# Altium schematic sheet Serial.SchDoc
size A3; PageSetup: Record=PageOptions|CenterHorizontal=True|CenterVertical=True|PrintScale=0.73|XCorrection=1.00|YCorrection=1.00|PrintKind=0|BorderSize=5000000|LeftOffset=0|BottomOffset=0|Orientation=2|PaperLength=1000|PaperWidth=1000|Scale=100|PaperSource=7|PrintQuality=-4|MediaType=1|DitherType=10|PaperKind=A4|PrintScaleMode=1; Date: 27.05.2014; DrawnBy: luths8; Organization: BFH; Address1: Bern University of Applied Sciences; Address2: Engineering and Information Technology; Address3: Jlcoweg 1; Address4: CH-3400 Burgdorf; DocumentNumber: 11; Revision: 1.1; SheetNumber: 11; SheetTotal: 16; CurrentDate: 27.05.2014
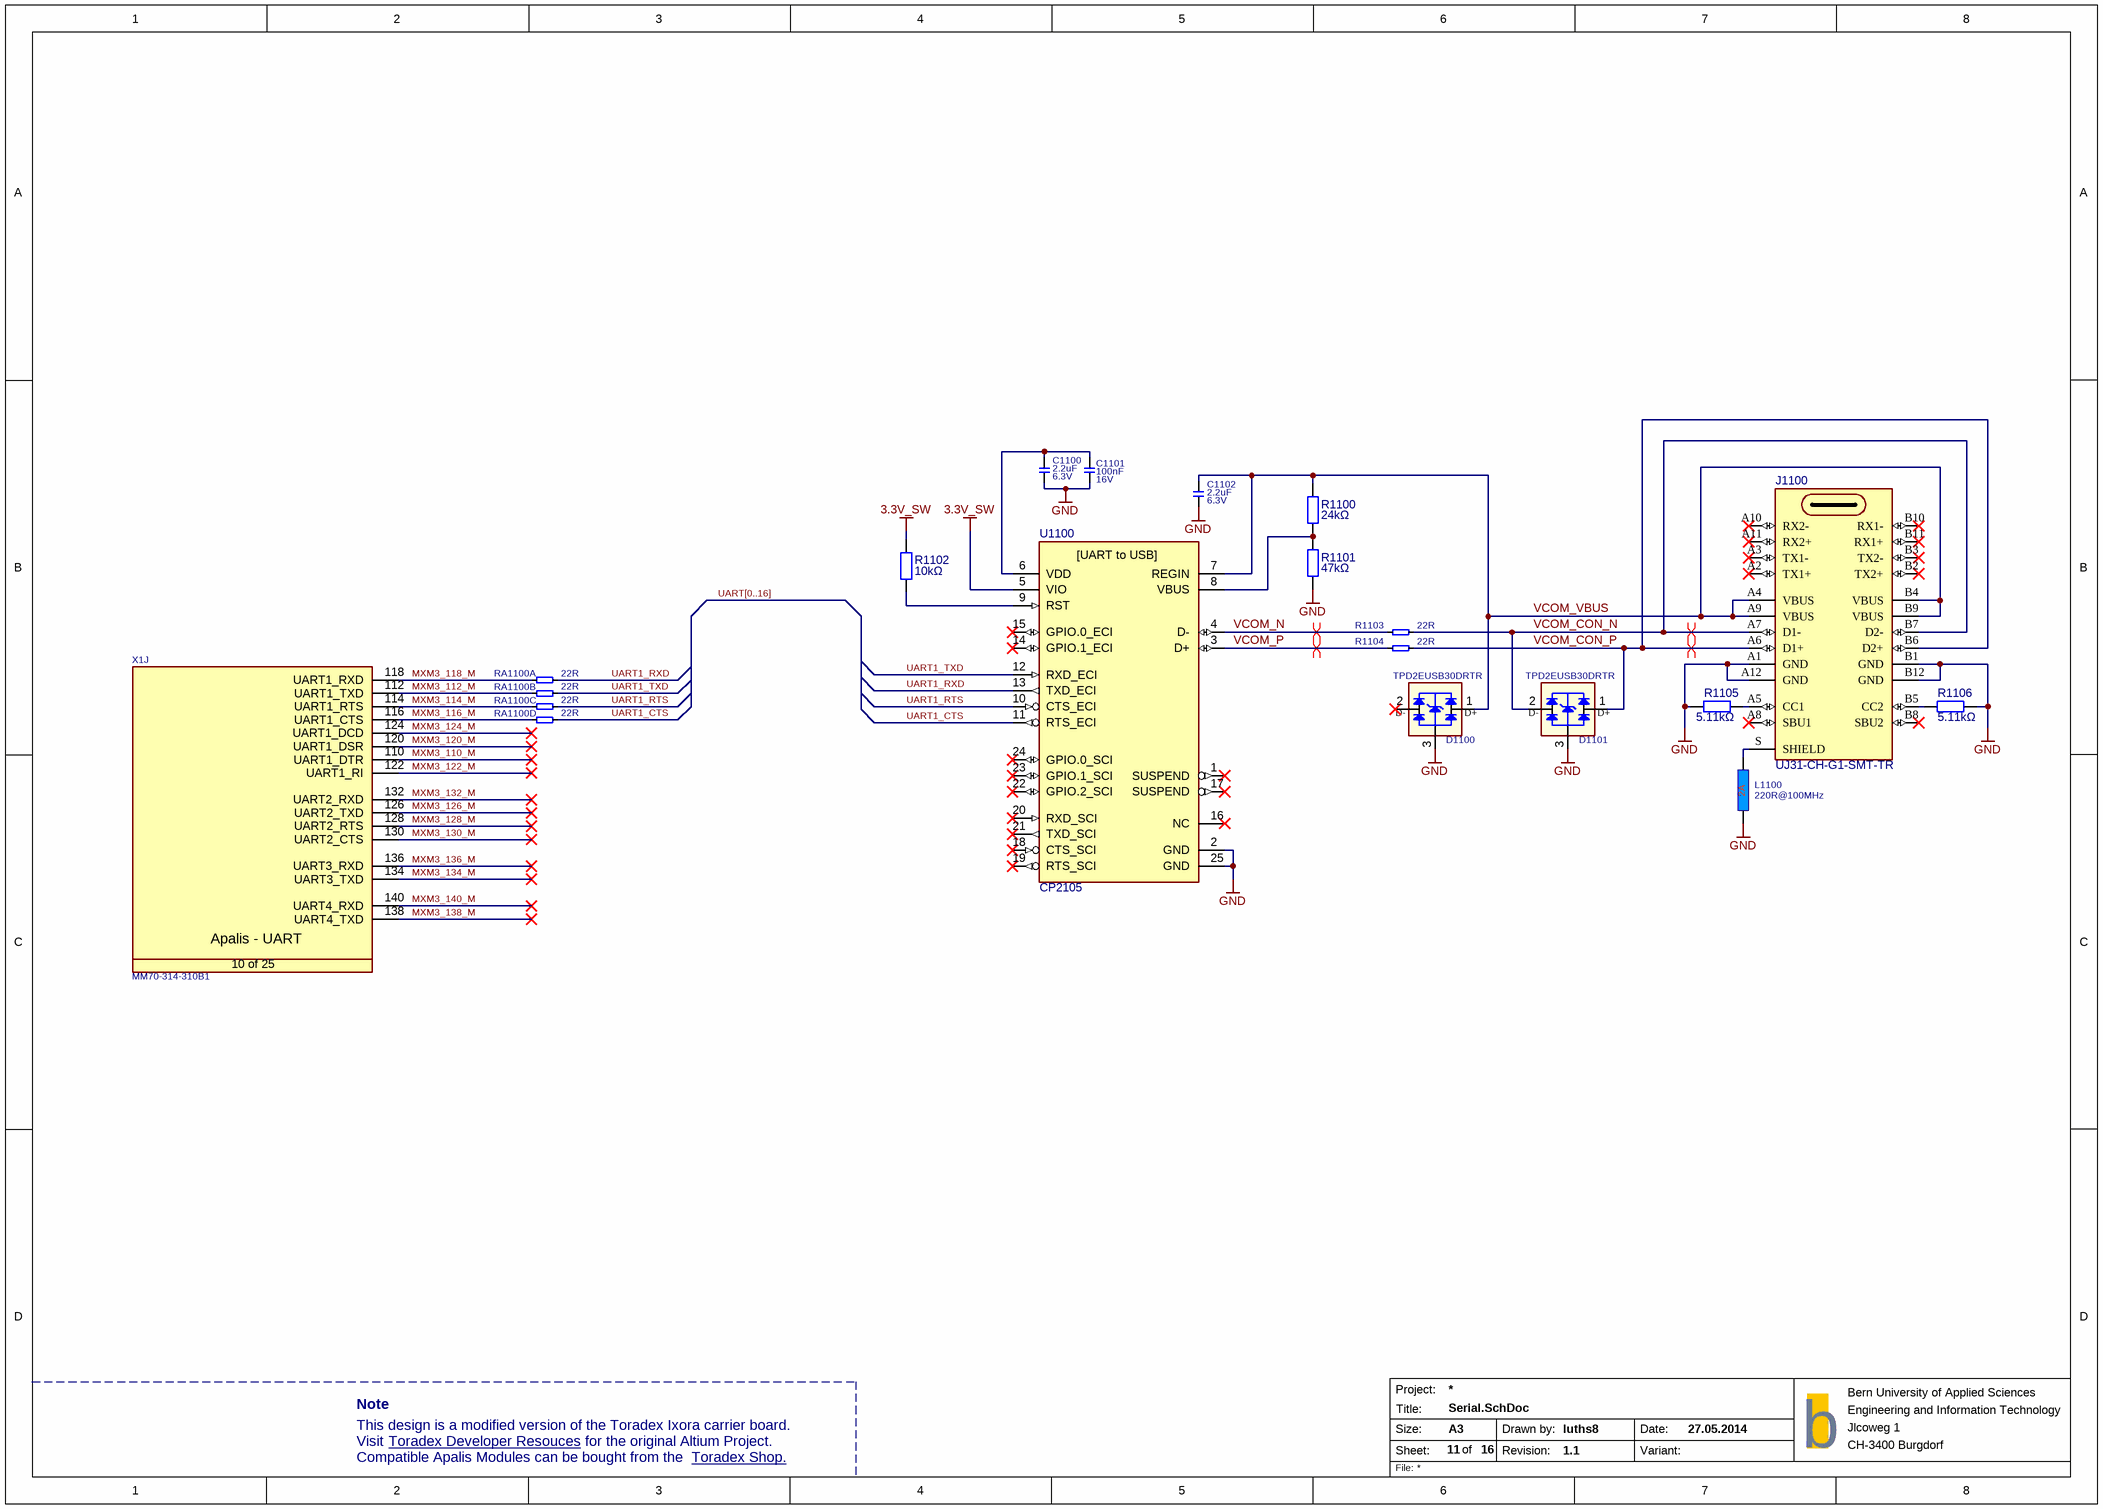
[diagram p0: Serial.SchDoc]

## Parts
C1100  Rating: 6.3V  [SMD0603CAP]  (hidden comment: 2.2uF)
C1101  Rating: 16V  [SMD0603CAP]  (hidden comment: 100nF)
C1102  Rating: 6.3V  [SMD0603CAP]  (hidden comment: 2.2uF)
D1100  TPD2EUSB30DRTR  [T_TI_TPD2EUSB30DRTR]
D1101  TPD2EUSB30DRTR  [T_TI_TPD2EUSB30DRTR]
J1100  UJ31-CH-G1-SMT-TR  [UJ31-CH-G1-SMT-TR]
L1100  220R@100MHz  [INDC1608X95N]
R1100  24kΩ  [SMD0603RES]
R1101  47kΩ  [SMD0603RES]
R1102  10kΩ  [SMD0603RES]
R1103  22R  [SMD0603RES]
R1104  22R  [SMD0603RES]
R1105  5.11kΩ  [SMD0603RES]
R1106  5.11kΩ  [SMD0603RES]
RA1100  22R  [T_Resistor_Array_X4]  (parts A,B,C,D of 4)
U1100  CP2105  [QFN24]
X1  Manufacturer Part No.: MM70-314-310B1  [T_JAE_MM70-314-310B1]  (hidden comment: CON-JAE-MM70-314-310B1-314-0.5mm)  (part J of 25)

## Nets
3.3V_SW: R1102.2 U1100.5(VIO)
GND: C1100.1 C1101.1 C1102.1 D1100.3 D1101.3 J1100.A1(GND) J1100.A12(GND) J1100.B1(GND) J1100.B12(GND) L1100.1 R1101.1 R1105.1 R1106.1 U1100.2(GND) U1100.25(GND)
MXM3_110_M: X1.110(UART1_DTR)
MXM3_112_M: RA1100.1 X1.112(UART1_TXD)
MXM3_114_M: RA1100.2 X1.114(UART1_RTS)
MXM3_116_M: RA1100.3 X1.116(UART1_CTS)
MXM3_118_M: RA1100.4 X1.118(UART1_RXD)
MXM3_120_M: X1.120(UART1_DSR)
MXM3_122_M: X1.122(UART1_RI)
MXM3_124_M: X1.124(UART1_DCD)
MXM3_126_M: X1.126(UART2_TXD)
MXM3_128_M: X1.128(UART2_RTS)
MXM3_130_M: X1.130(UART2_CTS)
MXM3_132_M: X1.132(UART2_RXD)
MXM3_134_M: X1.134(UART3_TXD)
MXM3_136_M: X1.136(UART3_RXD)
MXM3_138_M: X1.138(UART4_TXD)
MXM3_140_M: X1.140(UART4_RXD)
UART1_CTS: RA1100.7 U1100.11(RTS_ECI)
UART1_RTS: RA1100.6 U1100.10(CTS_ECI)
UART1_RXD: RA1100.8 U1100.13(TXD_ECI)
UART1_TXD: RA1100.5 U1100.12(RXD_ECI)
VCOM_CON_N: D1101.2(D-) J1100.A7(D1-) J1100.B7(D2-) R1103.2
VCOM_CON_P: D1101.1(D+) J1100.A6(D1+) J1100.B6(D2+) R1104.2
VCOM_N: R1103.1 U1100.4(D-)
VCOM_P: R1104.1 U1100.3(D+)
VCOM_VBUS: C1102.2 D1100.1(D+) J1100.A4(VBUS) J1100.A9(VBUS) J1100.B4(VBUS) J1100.B9(VBUS) R1100.2 U1100.7(REGIN)
NetC1100_2: C1100.2 C1101.2 U1100.6(VDD)
NetJ1100_A5: J1100.A5(CC1) R1105.2
NetJ1100_B5: J1100.B5(CC2) R1106.2
NetJ1100_S: J1100.S(SHIELD) L1100.2
NetR1100_1: R1100.1 R1101.2 U1100.8(VBUS)
NetR1102_1: R1102.1 U1100.9(RST)

Not connected (* = marked no-connect by the designer): D1100 2(D-)*; J1100 A2(TX1+)* A3(TX1-)* A8(SBU1)* A10(RX2-)* A11(RX2+)* B2(TX2+)* B3(TX2-)* B8(SBU2)* B10(RX1-)* B11(RX1+)*; U1100 1(SUSPEND)* 14(GPIO.1_ECI)* 15(GPIO.0_ECI)* 16(NC)* 17(SUSPEND)* 18(CTS_SCI)* 19(RTS_SCI)* 20(RXD_SCI)* 21(TXD_SCI)* 22(GPIO.2_SCI)* 23(GPIO.1_SCI)* 24(GPIO.0_SCI)*

## Buses and harness runs
bus UART[0..16]

## Layout directives
differential pair: VCOM_CON_N, VCOM_CON_P, VCOM_N, VCOM_P

## Notes on the sheet
- Note
- This design is a modified version of the Toradex Ixora carrier board.
- Visit
- Compatible Apalis Modules can be bought from the
- Toradex Developer Resouces <https://developer.toradex.com/products/ixora-carrier-board>
- for the original Altium Project.
- Toradex Shop. <https://www.toradex.com/order-now/apalis-arm-family>
- Project:
- Size:
- Sheet:
- Title:
- A3
- of
- Drawn by:
- Revision:
- Date:
- Variant:
- b
- File:
- (in symbol CON-JAE-MM70-314-310B1-314-0.5mm, part J) Apalis - UART; 10 of 25
- (in symbol CP2105) [UART to USB]

## Library data of the parts
C1100 C1102 = C-X5R-2.2uF-6.3V-20%-0603: Capacitor Ceramic X5R 2.2uF 6.3V 20% 0603; Tolerance: 20%; Type: X5R; Value: 2.2uF
C1101 = C-X7R-100nF-16V-10%-0402: Capacitor Ceramic X7R 100nF 16V 10% 0603; Tolerance: 10%; Type: X7R; Value: 100nF
D1100 D1101 = D-TI-TPD2EUSB30DRTR: 2 Channel Protection for Super Speed USB3.0; Manufacturer Name: TI; Manufacturer Part No.: TPD2EUSB30DRTR
J1100 = Connector USB C: USB Type C Jack; Manufacturer Part No.: UJ31-CH-G1-SMT-TR
L1100 = L-220R@100MHz-2A-25%-0603: 220R@100MHz 2A EMI FILTER; Tolerance: 25%; Rating: 2A; Value: 220R@100MHz
R1100-R1102 R1105 R1106 = Resistor
R1103 R1104 = R-22R-63mW-5%-0402: Resistor 22 ohm 63mW 5% 0603; Rating: 63mW; Tolerance: 5%; Value: 22R
RA1100 = RA-22R-63mW-5%-1206-div: Resistor Array 22 R 63mW 5% 1206; Tolerance: 5%; Power Dissipation: 63mW; Value: 22R
U1100 = CP2105: USB to UART Bridge; Manufacturer Part No.: CP2105-F01-GMR
X1 = CON-JAE-MM70-314-310B1-314-0.5mm: MXM3 Connector; Manufacturer Name: JAE; No. of ways: 314